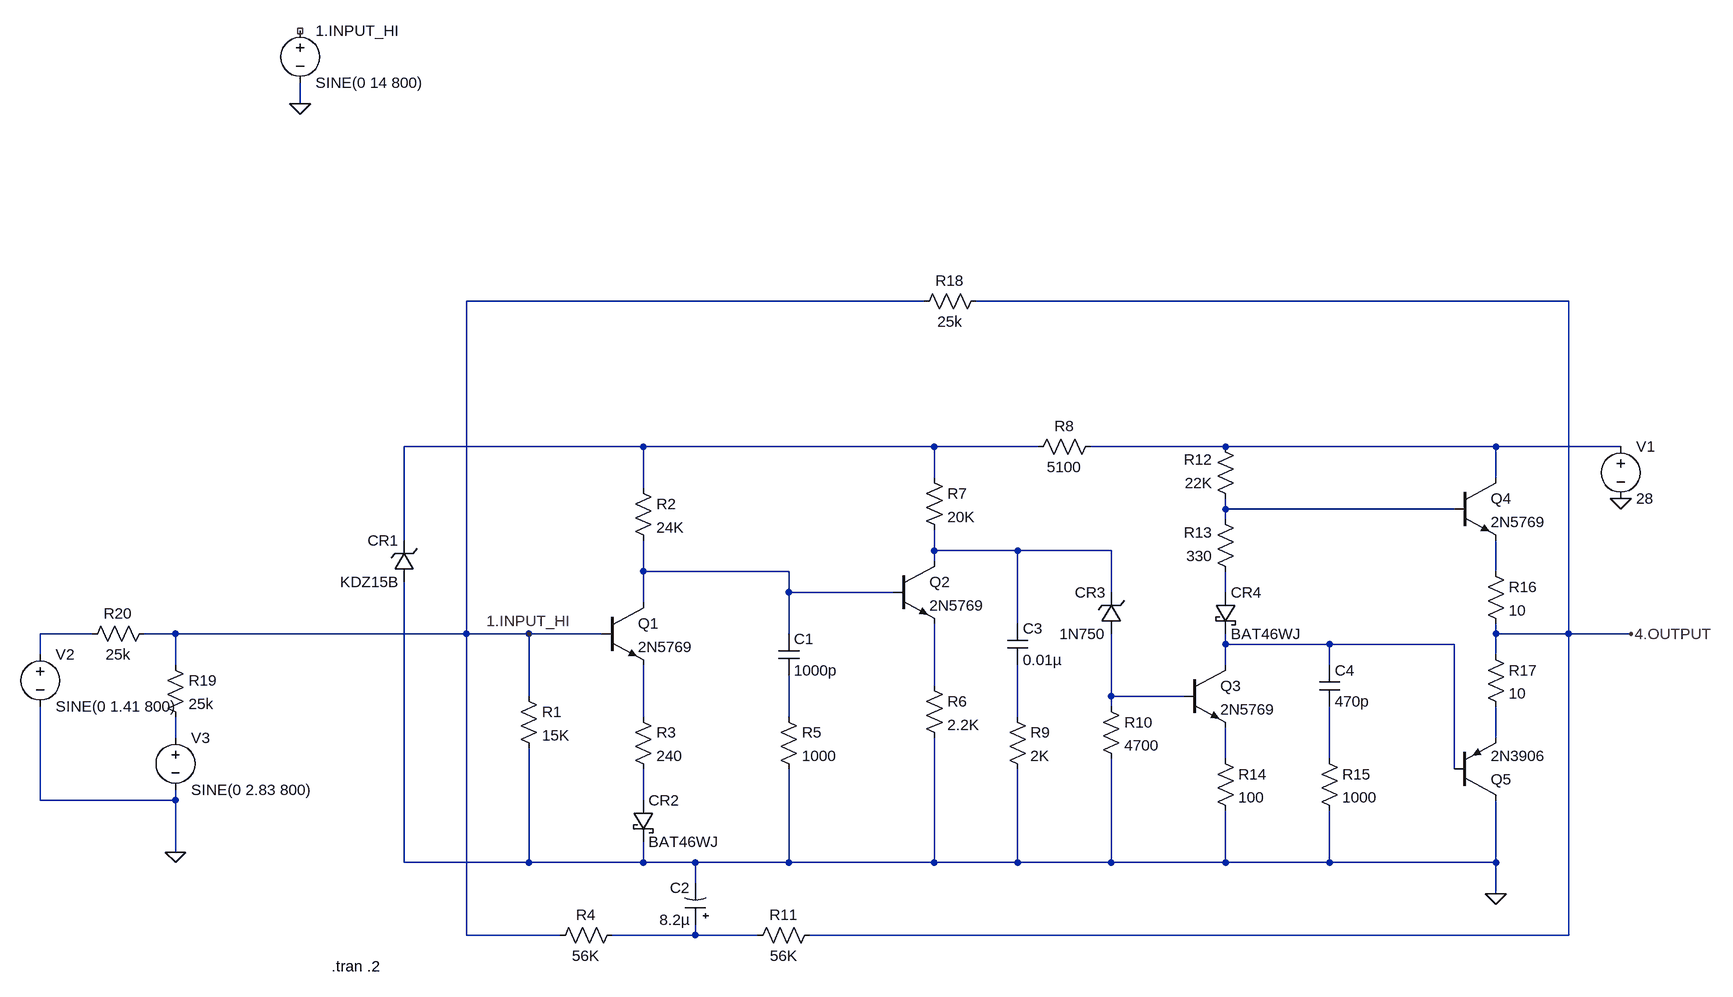
[diagram p0: schematic Op Amp CDU.asc]
Op Amp CDU.asc, the LTspice schematic file:
Version 4
SHEET 1 2040 788
WIRE -144 -560 -144 -592
WIRE 816 -256 112 -256
WIRE 1808 -256 896 -256
WIRE 384 -32 16 -32
WIRE 832 -32 384 -32
WIRE 992 -32 832 -32
WIRE 1280 -32 1072 -32
WIRE 1696 -32 1280 -32
WIRE 1888 -32 1696 -32
WIRE 832 16 832 -32
WIRE 1696 16 1696 -32
WIRE 384 32 384 -32
WIRE 1280 64 1280 48
WIRE 1632 64 1280 64
WIRE 1280 80 1280 64
WIRE 16 112 16 -32
WIRE 832 128 832 96
WIRE 960 128 832 128
WIRE 1104 128 960 128
WIRE 832 144 832 128
WIRE 384 160 384 112
WIRE 608 160 384 160
WIRE 1696 160 1696 112
WIRE 608 192 608 160
WIRE 768 192 608 192
WIRE 1104 192 1104 128
WIRE 1280 192 1280 160
WIRE 384 208 384 160
WIRE 960 240 960 128
WIRE -464 256 -544 256
WIRE -336 256 -384 256
WIRE 112 256 112 -256
WIRE 112 256 -336 256
WIRE 208 256 112 256
WIRE 320 256 208 256
WIRE 608 256 608 192
WIRE 1696 256 1696 240
WIRE 1808 256 1808 -256
WIRE 1808 256 1696 256
WIRE 1904 256 1808 256
WIRE 1280 272 1280 256
WIRE 1440 272 1280 272
WIRE 1632 272 1440 272
WIRE -544 288 -544 256
WIRE 1696 288 1696 256
WIRE -336 304 -336 256
WIRE 1280 304 1280 272
WIRE 1440 304 1440 272
WIRE 832 336 832 240
WIRE 208 352 208 256
WIRE 1104 352 1104 256
WIRE 1216 352 1104 352
WIRE 1104 368 1104 352
WIRE 384 384 384 304
WIRE 608 384 608 320
WIRE 960 384 960 304
WIRE -336 416 -336 384
WIRE 1696 416 1696 368
WIRE 1280 448 1280 400
WIRE 1440 448 1440 368
WIRE 1632 464 1632 272
WIRE -544 512 -544 368
WIRE -336 512 -336 496
WIRE -336 512 -544 512
WIRE 384 512 384 464
WIRE -336 592 -336 512
WIRE 16 608 16 176
WIRE 208 608 208 432
WIRE 208 608 16 608
WIRE 384 608 384 576
WIRE 384 608 208 608
WIRE 464 608 384 608
WIRE 608 608 608 464
WIRE 608 608 464 608
WIRE 832 608 832 416
WIRE 832 608 608 608
WIRE 960 608 960 464
WIRE 960 608 832 608
WIRE 1104 608 1104 448
WIRE 1104 608 960 608
WIRE 1280 608 1280 528
WIRE 1280 608 1104 608
WIRE 1440 608 1440 528
WIRE 1440 608 1280 608
WIRE 1696 608 1696 512
WIRE 1696 608 1440 608
WIRE 464 640 464 608
WIRE 1696 656 1696 608
WIRE 112 720 112 256
WIRE 256 720 112 720
WIRE 464 720 464 704
WIRE 464 720 336 720
WIRE 560 720 464 720
WIRE 1808 720 1808 256
WIRE 1808 720 640 720
FLAG -144 -560 0
FLAG 1696 656 0
FLAG 1904 256 4.OUTPUT
FLAG 1888 48 0
FLAG 208 256 1.INPUT_HI
FLAG -336 592 0
SYMBOL zener 32 176 R180
WINDOW 0 24 64 Left 2
WINDOW 3 24 0 Left 2
SYMATTR InstName CR1
SYMATTR Value KDZ15B
SYMATTR Description Diode
SYMATTR Type diode
SYMBOL voltage -144 -688 R0
WINDOW 123 0 0 Left 0
WINDOW 39 0 0 Left 0
SYMATTR InstName 1.INPUT_HI
SYMATTR Value SINE(0 14 800)
SYMBOL res 192 336 R0
SYMATTR InstName R1
SYMATTR Value 15K
SYMBOL npn 320 208 R0
SYMATTR InstName Q1
SYMATTR Value 2N5769
SYMBOL res 368 16 R0
SYMATTR InstName R2
SYMATTR Value 24K
SYMBOL res 368 368 R0
SYMATTR InstName R3
SYMATTR Value 240
SYMBOL res 352 704 R90
WINDOW 0 0 56 VBottom 2
WINDOW 3 32 56 VTop 2
SYMATTR InstName R4
SYMATTR Value 56K
SYMBOL schottky 368 512 R0
SYMATTR InstName CR2
SYMATTR Value BAT46WJ
SYMATTR Description Diode
SYMATTR Type diode
SYMBOL cap 592 256 R0
SYMATTR InstName C1
SYMATTR Value 1000p
SYMBOL res 592 368 R0
SYMATTR InstName R5
SYMATTR Value 1000
SYMBOL npn 768 144 R0
SYMATTR InstName Q2
SYMATTR Value 2N5769
SYMBOL res 816 320 R0
SYMATTR InstName R6
SYMATTR Value 2.2K
SYMBOL res 816 0 R0
SYMATTR InstName R7
SYMATTR Value 20K
SYMBOL res 1088 -48 R90
WINDOW 0 0 56 VBottom 2
WINDOW 3 32 56 VTop 2
SYMATTR InstName R8
SYMATTR Value 5100
SYMBOL polcap 480 704 R180
WINDOW 0 24 57 Left 2
WINDOW 3 24 8 Left 2
SYMATTR InstName C2
SYMATTR Value 8.2µ
SYMATTR Description Capacitor
SYMATTR Type cap
SYMATTR SpiceLine V=20
SYMBOL cap 944 240 R0
SYMATTR InstName C3
SYMATTR Value 0.01µ
SYMBOL res 944 368 R0
SYMATTR InstName R9
SYMATTR Value 2K
SYMBOL zener 1120 256 R180
WINDOW 0 24 64 Left 2
WINDOW 3 24 0 Left 2
SYMATTR InstName CR3
SYMATTR Value 1N750
SYMATTR Description Diode
SYMATTR Type diode
SYMBOL res 1088 352 R0
SYMATTR InstName R10
SYMATTR Value 4700
SYMBOL npn 1216 304 R0
SYMATTR InstName Q3
SYMATTR Value 2N5769
SYMBOL res 656 704 R90
WINDOW 0 0 56 VBottom 2
WINDOW 3 32 56 VTop 2
SYMATTR InstName R11
SYMATTR Value 56K
SYMBOL res 1296 64 R180
WINDOW 0 36 76 Left 2
WINDOW 3 36 40 Left 2
SYMATTR InstName R12
SYMATTR Value 22K
SYMBOL res 1296 176 R180
WINDOW 0 36 76 Left 2
WINDOW 3 36 40 Left 2
SYMATTR InstName R13
SYMATTR Value 330
SYMBOL schottky 1264 192 R0
SYMATTR InstName CR4
SYMATTR Value BAT46WJ
SYMATTR Description Diode
SYMATTR Type diode
SYMBOL res 1264 432 R0
SYMATTR InstName R14
SYMATTR Value 100
SYMBOL cap 1424 304 R0
SYMATTR InstName C4
SYMATTR Value 470p
SYMBOL res 1424 432 R0
SYMATTR InstName R15
SYMATTR Value 1000
SYMBOL pnp 1632 512 M180
SYMATTR InstName Q5
SYMATTR Value 2N3906
SYMBOL npn 1632 16 R0
SYMATTR InstName Q4
SYMATTR Value 2N5769
SYMBOL res 1680 144 R0
SYMATTR InstName R16
SYMATTR Value 10
SYMBOL res 1680 272 R0
SYMATTR InstName R17
SYMATTR Value 10
SYMBOL voltage 1888 -48 R0
WINDOW 123 0 0 Left 0
WINDOW 39 0 0 Left 0
SYMATTR InstName V1
SYMATTR Value 28
SYMBOL res 912 -272 R90
WINDOW 0 0 56 VBottom 2
WINDOW 3 32 56 VTop 2
SYMATTR InstName R18
SYMATTR Value 25k
SYMBOL voltage -544 272 R0
WINDOW 123 0 0 Left 0
WINDOW 39 0 0 Left 0
SYMATTR InstName V2
SYMATTR Value SINE(0 1.41 800)
SYMBOL voltage -336 400 R0
WINDOW 123 0 0 Left 0
WINDOW 39 0 0 Left 0
SYMATTR InstName V3
SYMATTR Value SINE(0 2.83 800)
SYMBOL res -352 288 R0
SYMATTR InstName R19
SYMATTR Value 25k
SYMBOL res -368 240 R90
WINDOW 0 0 56 VBottom 2
WINDOW 3 32 56 VTop 2
SYMATTR InstName R20
SYMATTR Value 25k
TEXT -96 768 Left 2 !.tran .2

The netlist it stands for:
* Op Amp CDU.asc
D§CR1 0 N001 KDZ15B
V§1.INPUT_HI NC_01 0 SINE(0 14 800)
R1 1.INPUT_HI 0 15K
Q1 N005 1.INPUT_HI N012 0 2N5769
R2 N001 N005 24K
R3 N012 N019 240
R4 N020 1.INPUT_HI 56K
D§CR2 N019 0 BAT46WJ
C1 N005 N013 1000p
R5 N013 0 1000
Q2 N004 N005 N010 0 2N5769
R6 N010 0 2.2K
R7 N001 N004 20K
R8 N002 N001 5100
C2 N020 0 8.2µ V=20
C3 N004 N014 0.01µ
R9 N014 0 2K
D§CR3 N011 N004 1N750
R10 N011 0 4700
Q3 N009 N011 N017 0 2N5769
R11 4.OUTPUT N020 56K
R12 N003 N002 22K
R13 N007 N003 330
D§CR4 N007 N009 BAT46WJ
R14 N017 0 100
C4 N009 N018 470p
R15 N018 0 1000
Q5 0 N009 N016 0 2N3906
Q4 N002 N003 N006 0 2N5769
R16 N006 4.OUTPUT 10
R17 4.OUTPUT N016 10
V1 N002 0 28
R18 4.OUTPUT 1.INPUT_HI 25k
V2 N008 0 SINE(0 1.41 800)
V3 N015 0 SINE(0 2.83 800)
R19 1.INPUT_HI N015 25k
R20 1.INPUT_HI N008 25k
.model D D
.lib standard.dio
.model NPN NPN
.model PNP PNP
.lib standard.bjt
.tran .2
.backanno
.end